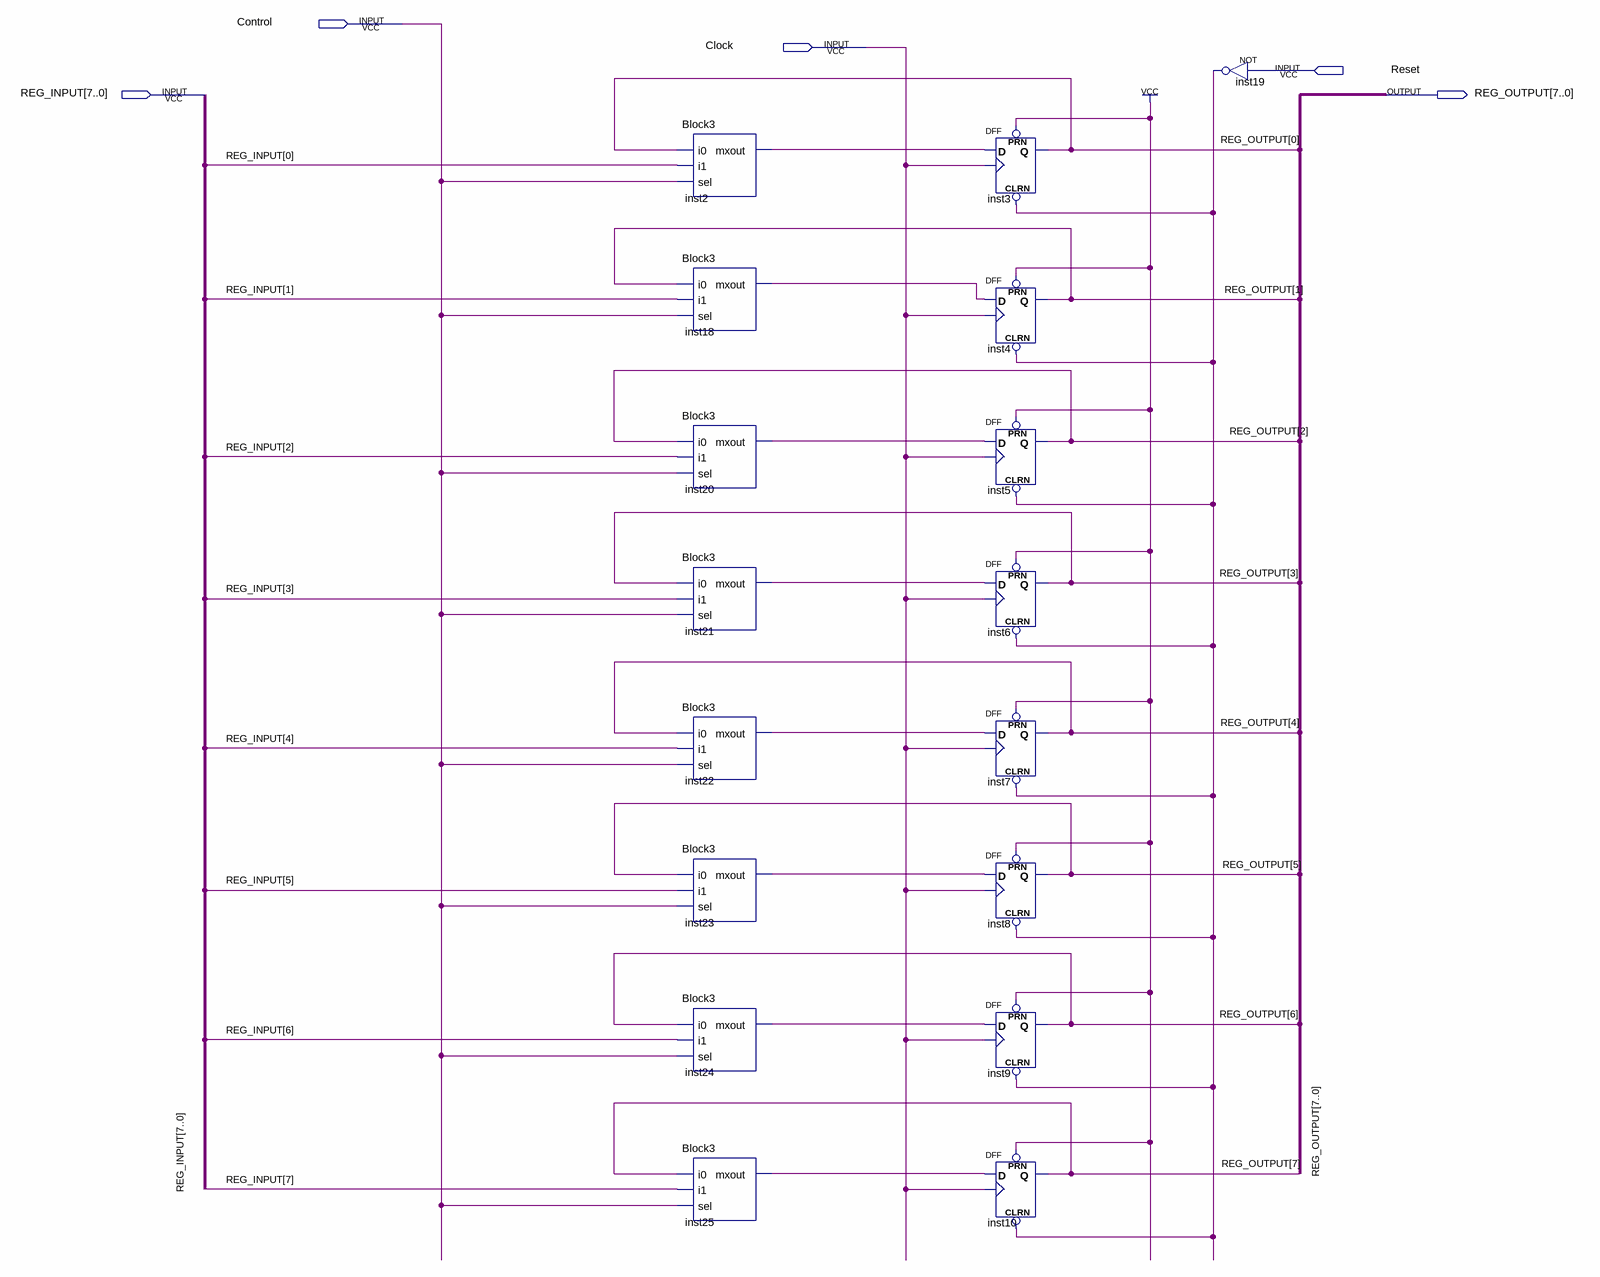
[diagram p0: schematic sheet]
// Quartus schematic Registers8bit.bdf as structural Verilog: 17 symbols, 5 pins
module Registers8bit (
  input  Control,
  input  Clock,
  input  Reset,
  input  [7:0] REG_INPUT,
  output [7:0] REG_OUTPUT
);

  wire inst2_mxout, inst18_mxout, inst19_out, inst20_mxout, inst21_mxout, inst22_mxout, inst23_mxout,
       inst24_mxout, inst25_mxout;

  Block3 inst2 (.i0(REG_OUTPUT[0]), .i1(REG_INPUT[0]), .sel(Control), .mxout(inst2_mxout));
  Block3 inst18 (.i0(REG_OUTPUT[1]), .i1(REG_INPUT[1]), .sel(Control), .mxout(inst18_mxout));
  Block3 inst20 (.i0(REG_OUTPUT[2]), .i1(REG_INPUT[2]), .sel(Control), .mxout(inst20_mxout));
  Block3 inst21 (.i0(REG_OUTPUT[3]), .i1(REG_INPUT[3]), .sel(Control), .mxout(inst21_mxout));
  Block3 inst22 (.i0(REG_OUTPUT[4]), .i1(REG_INPUT[4]), .sel(Control), .mxout(inst22_mxout));
  Block3 inst23 (.i0(REG_OUTPUT[5]), .i1(REG_INPUT[5]), .sel(Control), .mxout(inst23_mxout));
  Block3 inst24 (.i0(REG_OUTPUT[6]), .i1(REG_INPUT[6]), .sel(Control), .mxout(inst24_mxout));
  Block3 inst25 (.i0(REG_OUTPUT[7]), .i1(REG_INPUT[7]), .sel(Control), .mxout(inst25_mxout));
  DFF inst3 (.CLRN(inst19_out), .CLK(Clock), .D(inst2_mxout), .PRN(1'b1), .Q(REG_OUTPUT[0]));
  DFF inst4 (.CLRN(inst19_out), .CLK(Clock), .D(inst18_mxout), .PRN(1'b1), .Q(REG_OUTPUT[1]));
  DFF inst5 (.CLRN(inst19_out), .CLK(Clock), .D(inst20_mxout), .PRN(1'b1), .Q(REG_OUTPUT[2]));
  DFF inst6 (.CLRN(inst19_out), .CLK(Clock), .D(inst21_mxout), .PRN(1'b1), .Q(REG_OUTPUT[3]));
  DFF inst7 (.CLRN(inst19_out), .CLK(Clock), .D(inst22_mxout), .PRN(1'b1), .Q(REG_OUTPUT[4]));
  DFF inst8 (.CLRN(inst19_out), .CLK(Clock), .D(inst23_mxout), .PRN(1'b1), .Q(REG_OUTPUT[5]));
  DFF inst9 (.CLRN(inst19_out), .CLK(Clock), .D(inst24_mxout), .PRN(1'b1), .Q(REG_OUTPUT[6]));
  DFF inst10 (.CLRN(inst19_out), .CLK(Clock), .D(inst25_mxout), .PRN(1'b1), .Q(REG_OUTPUT[7]));
  not inst19 (inst19_out, Reset);
endmodule
